# Altium schematic sheet LIN-BUS.SchDoc: LIN Interfaces
size A4; Author: João Guimarães; Organization: Altium Limited; Address1: L3, 12a Rodborough Rd; Address2: Frenchs Forest; Address3: NSW; Address4: Australia 2086; Revision: 1.0; SheetNumber: 6; SheetTotal: 7
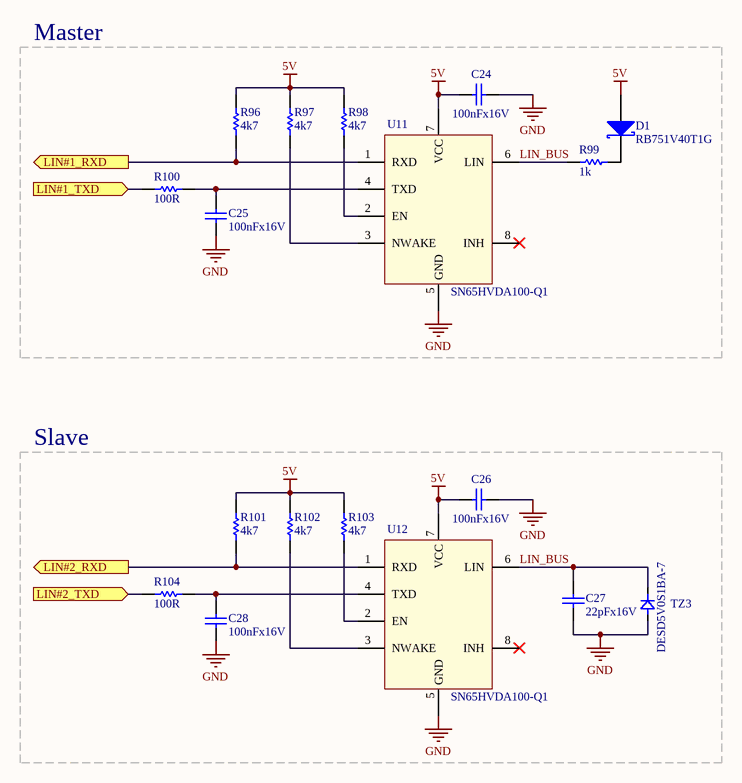
[diagram p0: LIN-BUS.SchDoc]

## Parts
C24  100nFx16V  [DISC-0603]
C25  100nFx16V  [DISC-0603]
C26  100nFx16V  [DISC-0603]
C27  22pFx16V  [DISC-0603]
C28  100nFx16V  [DISC-0603]
D1  RB751V40T1G  [DISC-SOD-323]
R96  4k7  [DISC-0603]
R97  4k7  [DISC-0603]
R98  4k7  [DISC-0603]
R99  1k  [DISC-0603]
R100  100R  [DISC-0603]
R101  4k7  [DISC-0603]
R102  4k7  [DISC-0603]
R103  4k7  [DISC-0603]
R104  100R  [DISC-0603]
TZ3  DESD5V0S1BA-7  [DISC-SOD-323]
U11  SN65HVDA100-Q1  [CI-SOIC-8]
U12  SN65HVDA100-Q1  [CI-SOIC-8]

## Blocks framed on the sheet
Master: C24 C25 D1 R96-R100 U11
Slave: C26-C28 R101-R104 TZ3 U12

## Ports
LIN#1_RXD (out), LIN#1_TXD (in), LIN#2_RXD (out), LIN#2_TXD (in)

## Nets
5V: C24.2 C26.2 D1.1(A) R96.2 R97.2 R98.2 R101.2 R102.2 R103.2 U11.7(VCC) U12.7(VCC)
GND: C24.1 C25.1 C26.1 C27.1 C28.1 TZ3.1(A) U11.5(GND) U12.5(GND)
LIN#1_RXD: R96.1 U11.1(RXD) ; port LIN#1_RXD
LIN#1_TXD: R100.2 ; port LIN#1_TXD
LIN#2_RXD: R101.1 U12.1(RXD) ; port LIN#2_RXD
LIN#2_TXD: R104.2 ; port LIN#2_TXD
LIN_BUS: C27.2 R99.2 TZ3.2(C) U11.6(LIN) U12.6(LIN)
NetC25_2: C25.2 R100.1 U11.4(TXD)
NetC28_2: C28.2 R104.1 U12.4(TXD)
NetD1_2: D1.2(K) R99.1
NetR97_1: R97.1 U11.3(NWAKE)
NetR98_1: R98.1 U11.2(EN)
NetR102_1: R102.1 U12.3(NWAKE)
NetR103_1: R103.1 U12.2(EN)

Not connected (* = marked no-connect by the designer): U11 8(INH)*; U12 8(INH)*

## Notes on the sheet
- Title:
- Project:
- Date:
- Author:
- Board:
- Version:
- Sheet:
- of

## Library data of the parts
C24-C26 C28 = Cap: Capacitor; PartNumber1: C0603C104Z3VACTU; Manufacturer1: Kemet; ClassName: LinBus
C27 = Cap: PartNumber1: CC0603JPNPO0BN220; Manufacturer1: Yageo; ClassName: LinBus
D1 = D Schottky: Schottky Diode; Manufacturer1: ONSemi; ClassName: LinBus; PartNumber1: RB751V40T1G
R96-R98 R101-R103 = Res: Resistor; PartNumber1: RC0603JR-074K7L; Manufacturer1: Yageo; ClassName: LinBus
R99 = Res: Resistor; PartNumber1: RC0603FR-071KL; Manufacturer1: Yageo; ClassName: LinBus
R100 R104 = Res: Resistor; PartNumber1: RC0603JR-07100RL; Manufacturer1: Yageo; ClassName: LinBus
TZ3 = TVZ-Unidirectional: Manufacturer1: Diodes; ClassName: LinBus; PartNumber1: DESD5V0S1BA-7
U11 U12 = SN65HVDA100-Q1: LIN Transceiver; Manufacturer1: TexasInstruments; ClassName: LinBus; PartNumber1: SN65HVDA100-Q1